# EAGLE design tsl-bt-shield (EAGLE 6.4)
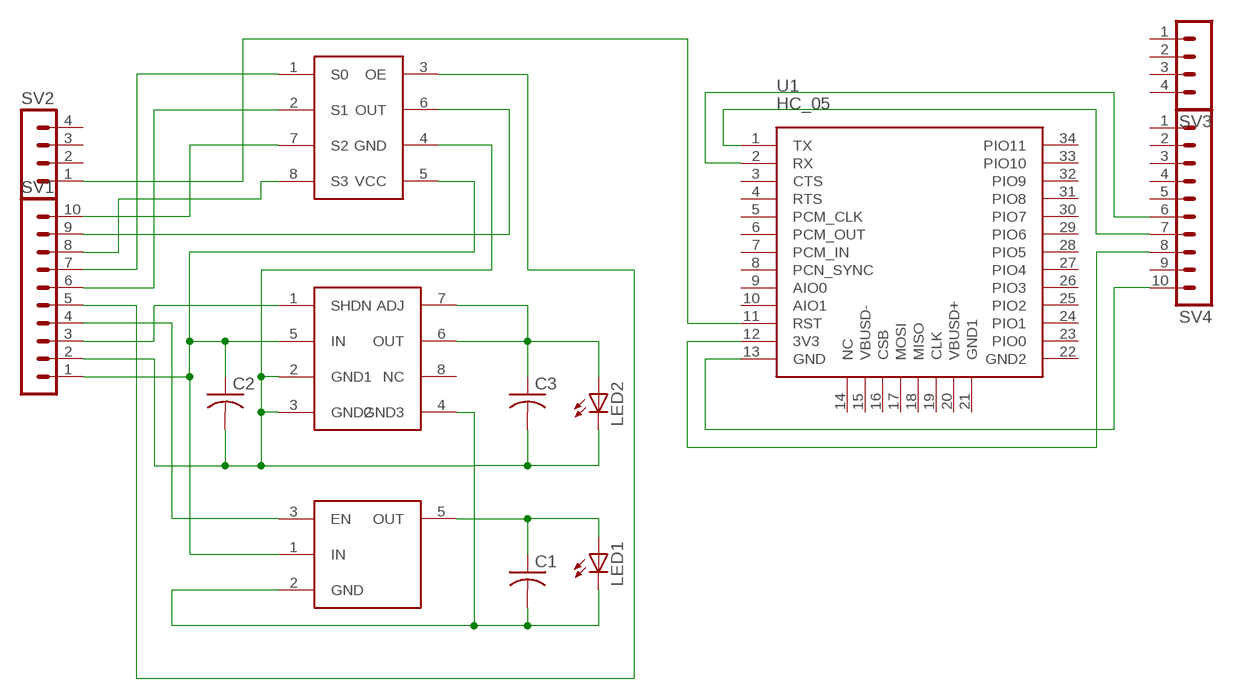
[diagram p0: schematic, sheet 1]

## Parts
C1  C-USC1206K  [C1206K]
C2  C-USC1206K  [C1206K]
C3  C-USC1206K  [C1206K]
LED1  LED  [SMARTLED-TTW]
LED2  LED  [SMARTLED-TTW]
SV1  MA10-1  [MA10-1]
SV2  MA04-1  [MA04-1]
SV3  MA04-1  [MA04-1]
SV4  MA10-1  [MA10-1]
U1  HC_05  [BLUETOOTH_SMD]
U$1  LT3008  [SOT23-8]
U$2  TPS7701  [SOT23-5]
U$3  TSL230  [TSL230-SOIC]

## Nets
N$1: C2.1 SV1.1 U$1.5(IN) U$2.1(IN) U$3.5(VCC)
N$2: C1.2 C2.2 C3.2 LED1.C@1(C) LED2.C@1(C) SV1.2 U$1.2(GND1) U$1.3(GND2) U$1.4(GND3) U$2.2(GND) U$3.4(GND)
N$3: C1.1 LED1.A@1(A) U$2.5(OUT)
N$4: C3.1 LED2.A@1(A) U$1.6(OUT) U$1.7(ADJ)
N$5: SV1.4 U$2.3(EN)
N$6: SV1.3 U$1.1(SHDN)
N$7: SV1.9 U$3.6(OUT)
N$8: SV1.5 U$3.3(OE)
N$9: SV1.7 U$3.1(S0)
N$10: SV1.6 U$3.2(S1)
N$11: SV1.10 U$3.7(S2)
N$12: SV1.8 U$3.8(S3)
N$13: SV2.1 U1.11(RST)
N$14: SV4.10 U1.13(GND)
N$15: SV4.8 U1.12(3V3)
N$16: SV4.7 U1.1(TX)
N$17: SV4.6 U1.2(RX)
Unconnected: SV2.2 SV2.3 SV2.4 SV3.1 SV3.2 SV3.3 SV3.4 SV4.1 SV4.2 SV4.3 SV4.4 SV4.5 SV4.9 U1.3(CTS) U1.4(RTS) U1.5(PCM_CLK) U1.6(PCM_OUT) U1.7(PCM_IN) U1.8(PCN_SYNC) U1.9(AIO0) U1.10(AIO1) U1.14(NC) U1.15(VBUSD-) U1.16(CSB) U1.17(MOSI) U1.18(MISO) U1.19(CLK) U1.20(VBUSD+) U1.21(GND1) U1.22(GND2) U1.23(PIO0) U1.24(PIO1) U1.25(PIO2) U1.26(PIO3) U1.27(PIO4) U1.28(PIO5) U1.29(PIO6) U1.30(PIO7) U1.31(PIO8) U1.32(PIO9) U1.33(PIO10) U1.34(PIO11) U$1.8(NC)

## Library data of the parts
C1-C3 = rcl:C-US: CAPACITOR, American symbol
LED1 LED2 = led:LED: LED OSRAM: - CHIPLED LG R971, LG N971, LY N971, LG Q971, LY Q971, LO R971, LY R971 LH N974, LH R974 LS Q976, LO Q976, LY Q976 LO Q996 - Hyper CHIPLED LW Q18S LB Q993, LB Q99A, LB R99A - SideLED LS A670, LO A670, LY A670, LG A670, LP A670 LB A673, LV A673, LT A673, LW A673 LH A674 LY A675 LS A676, LA A676, LO A676, LY A676, LW A676 LS A679, LY A679, LG A679 - Hyper Micro SIDELED® LS Y876, LA Y876, LO Y876, LY Y876 LT Y87S - SmartLED LW L88C, LW L88S LB L89C, LB L89S, LG L890 LS L89K, LO L89K, LY L89K LS L896, LA L896, LO L896, LY L896 - TOPLED LS T670, LO T670, LY T670, LG T670, LP T670 LSG T670, LSP T670, LSY T670, LOP T670, LYG T670 LG T671, LOG T671, LSG T671 LB T673, LV T673, LT T673, LW T673 LH T674 LS T676, LA T676, LO T676, LY T676, LB T676, LH T676, LSB T676, LW T676 LB T67C, LV T67C, LT T67C, LS T67K, LO T67K, LY T67K, LW E67C LS E67B, LA E67B, LO E67B, LY E67B, LB E67C, LV E67C, LT E67C LW T67C LS T679, LY T679, LG T679 LS T770, LO T770, LY T770, LG T770, LP T770 LB T773, LV T773, LT T773, LW T773 LH T774 LS E675, LA E675, LY E675, LS T675 LS T776, LA T776, LO T776, LY T776, LB T776 LHGB T686 LT T68C, LB T68C - Hyper Mini TOPLED® LB M676 - Mini TOPLED Santana® LG M470 LS M47K, LO M47K, LY M47K Source: http://www.osram.convergy.de LUXEON: - LUMILED® LXK2-PW12-R00, LXK2-PW12-S00, LXK2-PW14-U00, LXK2-PW14-V00 LXK2-PM12-R00, LXK2-PM12-S00, LXK2-PM14-U00 LXK2-PE12-Q00, LXK2-PE12-R00, LXK2-PE12-S00, LXK2-PE14-T00, LXK2-PE14-U00 LXK2-PB12-K00, LXK2-PB12-L00, LXK2-PB12-M00, LXK2-PB14-N00, LXK2-PB14-P00, LXK2-PB14-Q00 LXK2-PR12-L00, LXK2-PR12-M00, LXK2-PR14-Q00, LXK2-PR14-R00 LXK2-PD12-Q00, LXK2-PD12-R00, LXK2-PD12-S00 LXK2-PH12-R00, LXK2-PH12-S00 LXK2-PL12-P00, LXK2-PL12-Q00, LXK2-PL12-R00 Source: www.luxeon.com KINGBRIGHT: KA-3528ASYC Source: www.kingbright.com
SV1 SV4 = con-lstb:MA10-1: PIN HEADER; OC_FARNELL: unknown; OC_NEWARK: unknown
SV2 SV3 = con-lstb:MA04-1: PIN HEADER; OC_FARNELL: unknown; OC_NEWARK: unknown
U1 = SerialPortBluetooth:HC_05
U$1 = Sleepwalker:LT3008
U$2 = Sleepwalker:TPS7701
U$3 = Sleepwalker:TSL230: TAOS TSL230 light to frequency converter

## Board
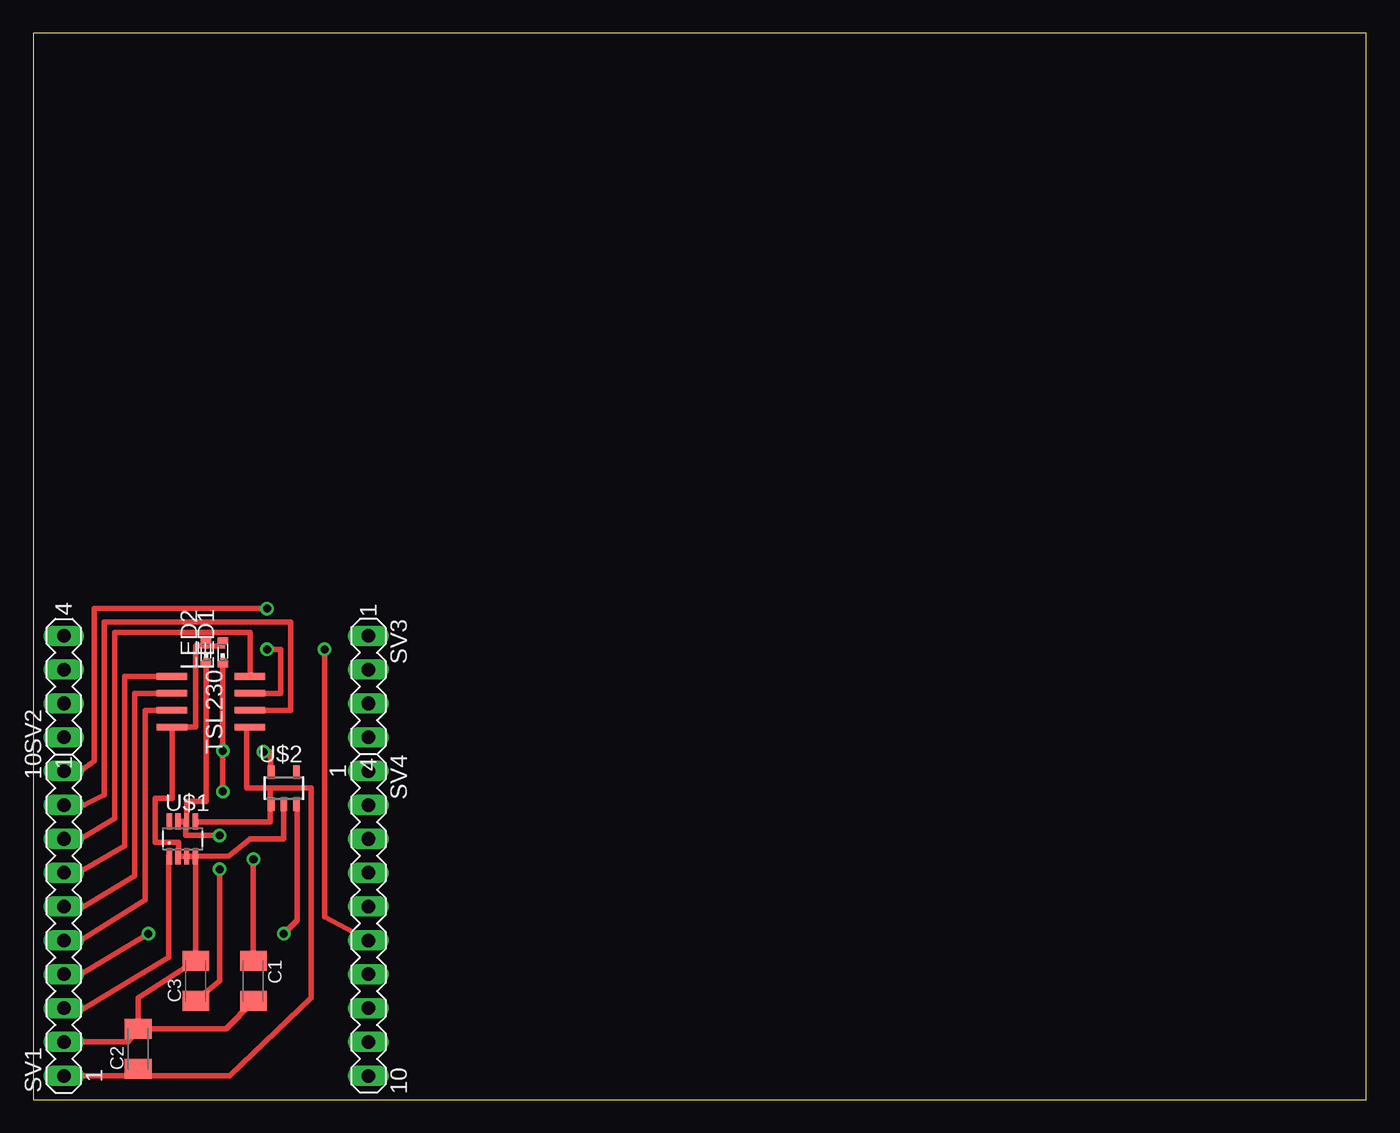
[diagram p1: board, top side]
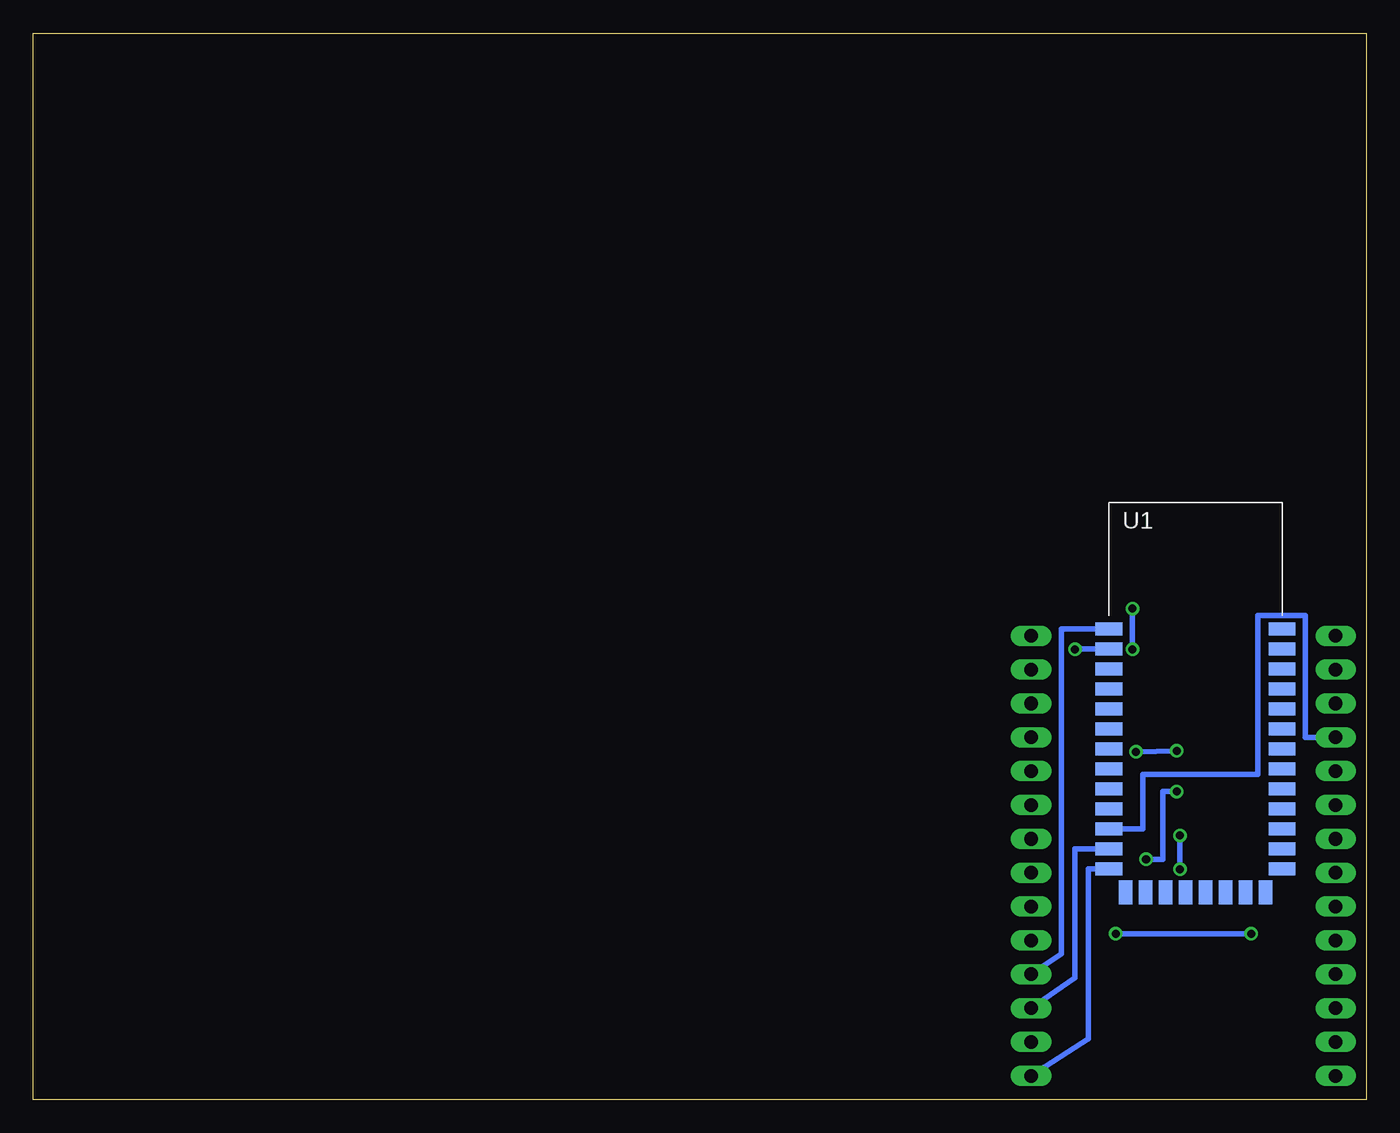
[diagram p2: board, bottom side, seen from below]

Size 100 x 80 mm. Coordinates in mm from the lower left corner, seen from the top.
Outline: 0,0 100,0 100,80 0,80 0,0
Copper layers (1*16): Top 0.035mm / dielectric 1.5mm / Bottom 0.035mm
Design rules "default": minimum track width 10mil, minimum drill 24mil, track to track 8mil, track to pad 8mil, pad to pad 8mil, via to via 8mil, smd to smd 8mil, copper to edge 40mil, drill to drill 8mil, minimum pad ring 10mil, minimum via ring 8mil, stop-mask expansion 4mil, vias tented up to drill 0mil, thermal gap 10mil

### Footprints (pad centres in the part's own frame; a part is rotated, then mirrored left to right if it is on the bottom)
C1206K = smd 1.5 x 2: 1 -1.5,0; 2 1.5,0
SMARTLED-TTW = smd 0.8 x 0.5: A 0,-0.875; C 0,0.875 | smd 0.35 x 0.35: A@1 0,-0.5; C@1 0,0.5
MA10-1 = drill 1.016 long: 1 -11.43,0; 2 -8.89,0; 3 -6.35,0; 4 -3.81,0; 5 -1.27,0; 6 1.27,0; 7 3.81,0; 8 6.35,0; 9 8.89,0; 10 11.43,0
MA04-1 = drill 1.016 long: 1 -3.81,0; 2 -1.27,0; 3 1.27,0; 4 3.81,0
BLUETOOTH_SMD = smd 2 x 1: 1 0,0; 2 0,-1.5; 3 0,-3; 4 0,-4.5; 5 0,-6; 6 0,-7.5; 7 0,-9; 8 0,-10.5; 9 0,-12; 10 0,-13.5; 11 0,-15; 12 0,-16.5; 13 0,-18; 22 13,-18; 23 13,-16.5; 24 13,-15; 25 13,-13.5; 26 13,-12; 27 13,-10.5; 28 13,-9; 29 13,-7.5; 30 13,-6; 31 13,-4.5; 32 13,-3; 33 13,-1.5; 34 13,0 | smd 1 x 1.8: 14 1.25,-19.75; 15 2.75,-19.75; 16 4.25,-19.75; 17 5.75,-19.75; 18 7.25,-19.75; 19 8.75,-19.75; 20 10.25,-19.75; 21 11.75,-19.75
SOT23-8 = smd 0.4 x 1.2: 1 -0.975,-1.3; 2 -0.325,-1.3; 3 0.325,-1.3; 4 0.975,-1.3; 5 0.975,1.3; 6 0.325,1.3; 7 -0.325,1.3; 8 -0.975,1.3
SOT23-5 = smd 0.5 x 1: 1 -0.95,-1.2; 2 0,-1.2; 3 0.95,-1.2; 4 0.95,1.2; 5 -0.95,1.2
TSL230-SOIC = smd 0.508 x 2.286: 1 -4.572,0.508; 2 -3.302,0.508; 3 -2.032,0.508; 4 -0.762,0.508; 5 -0.762,6.35; 6 -2.032,6.35; 7 -3.302,6.35; 8 -4.572,6.35

### Placement (x,y rotation side)
C1  16.51,8.89 270 top
C2  7.87,3.81 90 top
C3  12.19,8.89 90 top
LED1  14.22,33.53 0 top
LED2  12.95,33.53 0 top
SV1  2.29,13.21 90 top
SV2  2.29,30.99 90 top
SV3  25.15,30.99 270 top
SV4  25.15,13.21 270 top
U1  19.3,35.31 0 bottom
U$1  11.18,19.56 0 top
U$2  18.8,23.37 0 top
U$3  9.91,27.18 270 top

### Tracks (layer width: path | path; a pad name or v marks a point on that pad's centre or on a via)
N$1
  Top 0.406: SV1.1 7.87,1.78 | 17.78,22.17 17.78,23.37 | 17.78,23.37 20.83,23.37 20.83,7.62 14.73,1.78 7.87,1.78 | 7.87,1.78 C2.1 | U$2.1 17.78,22.17 | 17.78,22.17 17.78,20.83 12.15,20.83 U$1.5 | U$3.5 16,27.94 16,23.37 17.78,23.37
N$2
  Top 0.406: SV1.2 7.11,4.32 C2.2 | C2.2 14.48,5.31 16.51,7.37 | C2.2 7.87,7.62 C3.2 12.19,17.24 U$1.4 | U$1.4 12.19,18.26 12.19,18.03 | U$1.4 U$1.3 U$1.2 10.92,18.26 10.92,19.3 9.14,19.3 9.14,22.61 10.41,22.61 U$3.4 12.19,27.94 12.19,34.04 LED2.C@1 LED1.C@1 | U$2.2 18.8,19.56 16.26,19.56 14.69,18.29 U$1.4 | C1.2 16.51,7.37 | 16.51,7.37 16.51,7.14
N$3  (via drill 0.6)
  Top 0.406: U$2.5 17.78,26.09 v17.27,26.09 | LED1.A@1 v14.22,26.16 v14.22,23.11 | v16.53,18.03 v16.51,18.03 C1.1
  Bottom 0.406: v17.27,26.09 v14.22,26.16 | v14.22,23.11 15.24,23.11 15.24,18.03 v16.53,18.03
N$4  (via drill 0.6)
  Top 0.406: LED2.A@1 12.95,22.35 11.5,22.35 U$1.6 11.5,20.83 10.92,20.83 10.92,20.86 U$1.7 11.43,20.86 11.43,19.81 v13.97,19.81 | v13.97,17.27 13.97,9.65 13.97,8.89 C3.1
  Bottom 0.406: v13.97,19.81 v13.97,17.27
N$5  (via drill 0.6)
  Top 0.406: U$2.3 19.81,22.17 19.81,13.46 v18.8,12.45 | v8.64,12.45 3.56,9.4 SV1.4
  Bottom 0.406: v18.8,12.45 v8.64,12.45
N$6
  Top 0.406: SV1.3 3.81,6.86 10.16,10.67 10.16,18.26 U$1.1
N$7
  Top 0.406: U$3.6 19.3,29.21 19.3,35.81 5.33,35.81 5.33,22.86 3.81,22.1 SV1.9
N$8
  Top 0.406: U$3.3 8.38,29.21 8.38,14.99 3.56,11.94 SV1.5
N$9
  Top 0.406: U$3.1 6.86,31.75 6.86,19.05 3.81,17.27 2.29,17.27 SV1.7
N$10
  Top 0.406: U$3.2 7.62,30.48 7.62,16.76 3.81,14.48 SV1.6
N$11  (via drill 0.6)
  Top 0.406: SV1.10 3.56,24.64 4.57,25.4 4.57,36.83 v17.53,36.83 | v17.53,33.78 18.54,33.78 18.54,30.48 U$3.7
  Bottom 0.406: v17.53,36.83 v17.53,33.78
N$12
  Top 0.406: U$3.8 16.26,35.05 6.1,35.05 6.1,21.08 3.56,19.56 SV1.8
N$13
  Bottom 0.406: SV2.1 4.57,27.18 4.57,36.32 8.13,36.32 8.13,24.38 16.76,24.38 16.76,20.32 U1.11
N$14
  Bottom 0.406: U1.13 20.83,17.31 20.83,4.57 SV4.10
N$15
  Bottom 0.406: U1.12 21.84,18.81 21.84,9.14 SV4.8
N$16
  Bottom 0.406: U1.1 22.86,35.31 22.86,10.92 SV4.7
N$17  (via drill 0.6)
  Top 0.406: SV4.6 21.84,13.72 v21.84,33.78
  Bottom 0.406: U1.2 21.84,33.81 v21.84,33.78